# Vivado block design design_2, xc7z020clg400-1, Vivado 2024.2
# (continued, part 2 of 3)
current_bd_instance /zlcfq_sixteen/half_mul1/zlcfq/addcell13
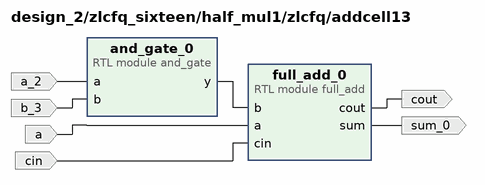
[diagram p24: block diagram inside /zlcfq_sixteen/half_mul1/zlcfq/addcell13]
create_bd_pin -dir I cin
create_bd_pin -dir O cout
create_bd_pin -dir I a
create_bd_pin -dir O sum_0
create_bd_pin -dir I a_2
create_bd_pin -dir I b_3

create_bd_cell -type module -reference full_add full_add_0
create_bd_cell -type module -reference and_gate and_gate_0

# ---- hierarchy /zlcfq_sixteen/half_mul1/zlcfq/addcell1 ----
current_bd_instance /zlcfq_sixteen/half_mul1/zlcfq/addcell1
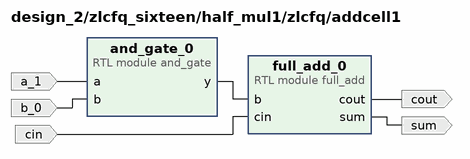
[diagram p25: block diagram inside /zlcfq_sixteen/half_mul1/zlcfq/addcell1]
create_bd_pin -dir I cin
create_bd_pin -dir O cout
create_bd_pin -dir O sum
create_bd_pin -dir I a_1
create_bd_pin -dir I b_0

create_bd_cell -type module -reference full_add full_add_0
create_bd_cell -type module -reference and_gate and_gate_0

# ---- hierarchy /zlcfq_sixteen/half_mul1/zlcfq/addcell2 ----
current_bd_instance /zlcfq_sixteen/half_mul1/zlcfq/addcell2
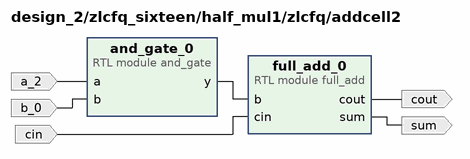
[diagram p26: block diagram inside /zlcfq_sixteen/half_mul1/zlcfq/addcell2]
create_bd_pin -dir I cin
create_bd_pin -dir O cout
create_bd_pin -dir O sum
create_bd_pin -dir I a_2
create_bd_pin -dir I b_0

create_bd_cell -type module -reference full_add full_add_0
create_bd_cell -type module -reference and_gate and_gate_0

# ---- hierarchy /zlcfq_sixteen/half_mul1/zlcfq/addcell14 ----
current_bd_instance /zlcfq_sixteen/half_mul1/zlcfq/addcell14
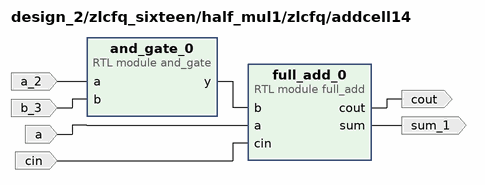
[diagram p27: block diagram inside /zlcfq_sixteen/half_mul1/zlcfq/addcell14]
create_bd_pin -dir I cin
create_bd_pin -dir O cout
create_bd_pin -dir I a
create_bd_pin -dir O sum_1
create_bd_pin -dir I a_2
create_bd_pin -dir I b_3

create_bd_cell -type module -reference full_add full_add_0
create_bd_cell -type module -reference and_gate and_gate_0

# ---- hierarchy /zlcfq_sixteen/half_mul1/zlcfq/addcell3 ----
current_bd_instance /zlcfq_sixteen/half_mul1/zlcfq/addcell3
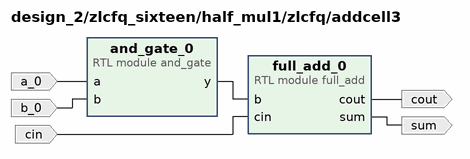
[diagram p28: block diagram inside /zlcfq_sixteen/half_mul1/zlcfq/addcell3]
create_bd_pin -dir I cin
create_bd_pin -dir O sum
create_bd_pin -dir O cout
create_bd_pin -dir I a_0
create_bd_pin -dir I b_0

create_bd_cell -type module -reference full_add full_add_0
create_bd_cell -type module -reference and_gate and_gate_0

# ---- hierarchy /zlcfq_sixteen/half_mul1/zlcfq/addcell4 ----
current_bd_instance /zlcfq_sixteen/half_mul1/zlcfq/addcell4
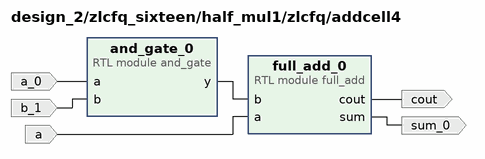
[diagram p29: block diagram inside /zlcfq_sixteen/half_mul1/zlcfq/addcell4]
create_bd_pin -dir I a
create_bd_pin -dir O cout
create_bd_pin -dir O sum_0
create_bd_pin -dir I a_0
create_bd_pin -dir I b_1

create_bd_cell -type module -reference full_add full_add_0
create_bd_cell -type module -reference and_gate and_gate_0

# ---- hierarchy /zlcfq_sixteen/half_mul1/zlcfq/addcell5 ----
current_bd_instance /zlcfq_sixteen/half_mul1/zlcfq/addcell5
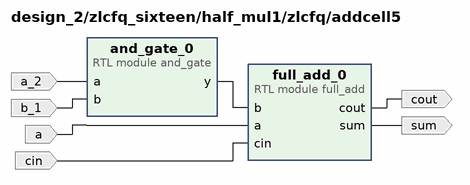
[diagram p30: block diagram inside /zlcfq_sixteen/half_mul1/zlcfq/addcell5]
create_bd_pin -dir I cin
create_bd_pin -dir O cout
create_bd_pin -dir I a
create_bd_pin -dir O sum
create_bd_pin -dir I a_2
create_bd_pin -dir I b_1

create_bd_cell -type module -reference full_add full_add_0
create_bd_cell -type module -reference and_gate and_gate_0

# ---- hierarchy /zlcfq_sixteen/half_mul1/zlcfq/addcell6 ----
current_bd_instance /zlcfq_sixteen/half_mul1/zlcfq/addcell6
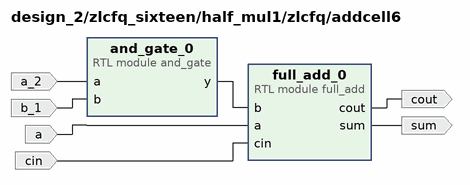
[diagram p31: block diagram inside /zlcfq_sixteen/half_mul1/zlcfq/addcell6]
create_bd_pin -dir I cin
create_bd_pin -dir O cout
create_bd_pin -dir I a
create_bd_pin -dir O sum
create_bd_pin -dir I a_2
create_bd_pin -dir I b_1

create_bd_cell -type module -reference full_add full_add_0
create_bd_cell -type module -reference and_gate and_gate_0

# ---- hierarchy /zlcfq_sixteen/half_mul1/zlcfq/addcell7 ----
current_bd_instance /zlcfq_sixteen/half_mul1/zlcfq/addcell7
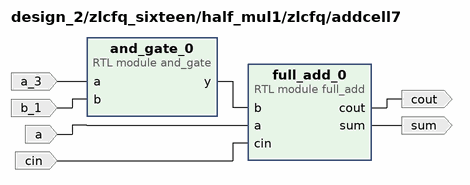
[diagram p32: block diagram inside /zlcfq_sixteen/half_mul1/zlcfq/addcell7]
create_bd_pin -dir I cin
create_bd_pin -dir O sum
create_bd_pin -dir I a
create_bd_pin -dir O cout
create_bd_pin -dir I a_3
create_bd_pin -dir I b_1

create_bd_cell -type module -reference full_add full_add_0
create_bd_cell -type module -reference and_gate and_gate_0

# ---- hierarchy /zlcfq_sixteen/half_mul1/zlcfq/addcell8 ----
current_bd_instance /zlcfq_sixteen/half_mul1/zlcfq/addcell8
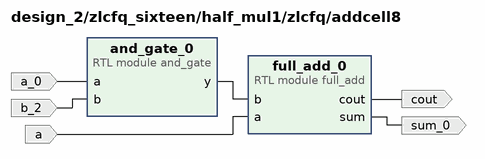
[diagram p33: block diagram inside /zlcfq_sixteen/half_mul1/zlcfq/addcell8]
create_bd_pin -dir O cout
create_bd_pin -dir I a
create_bd_pin -dir O sum_0
create_bd_pin -dir I a_0
create_bd_pin -dir I b_2

create_bd_cell -type module -reference full_add full_add_0
create_bd_cell -type module -reference and_gate and_gate_0

# ---- hierarchy /zlcfq_sixteen/half_mul1/zlcfq/addcell9 ----
current_bd_instance /zlcfq_sixteen/half_mul1/zlcfq/addcell9
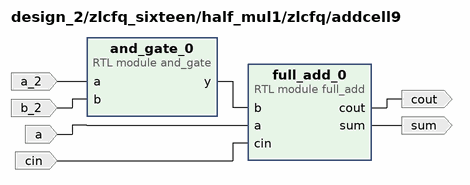
[diagram p34: block diagram inside /zlcfq_sixteen/half_mul1/zlcfq/addcell9]
create_bd_pin -dir O cout
create_bd_pin -dir I cin
create_bd_pin -dir I a
create_bd_pin -dir O sum
create_bd_pin -dir I a_2
create_bd_pin -dir I b_2

create_bd_cell -type module -reference full_add full_add_0
create_bd_cell -type module -reference and_gate and_gate_0

# ---- hierarchy /zlcfq_sixteen/half_mul1/zlcfq/addcell10 ----
current_bd_instance /zlcfq_sixteen/half_mul1/zlcfq/addcell10
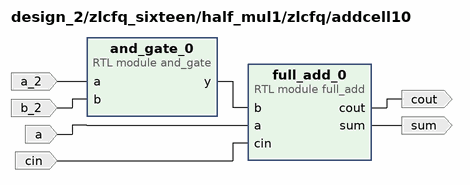
[diagram p35: block diagram inside /zlcfq_sixteen/half_mul1/zlcfq/addcell10]
create_bd_pin -dir O cout
create_bd_pin -dir I cin
create_bd_pin -dir I a
create_bd_pin -dir O sum
create_bd_pin -dir I a_2
create_bd_pin -dir I b_2

create_bd_cell -type module -reference full_add full_add_0
create_bd_cell -type module -reference and_gate and_gate_0

# ---- hierarchy /zlcfq_sixteen/half_mul1/zlcfq/addcell11 ----
current_bd_instance /zlcfq_sixteen/half_mul1/zlcfq/addcell11
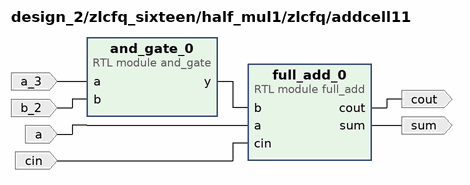
[diagram p36: block diagram inside /zlcfq_sixteen/half_mul1/zlcfq/addcell11]
create_bd_pin -dir I cin
create_bd_pin -dir I a
create_bd_pin -dir O sum
create_bd_pin -dir O cout
create_bd_pin -dir I a_3
create_bd_pin -dir I b_2

create_bd_cell -type module -reference full_add full_add_0
create_bd_cell -type module -reference and_gate and_gate_0

# ---- hierarchy /zlcfq_sixteen/half_mul1/zlcfq/addcell12 ----
current_bd_instance /zlcfq_sixteen/half_mul1/zlcfq/addcell12
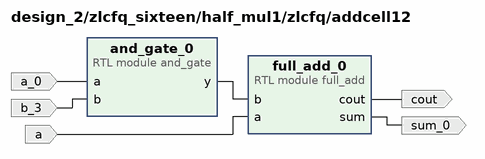
[diagram p37: block diagram inside /zlcfq_sixteen/half_mul1/zlcfq/addcell12]
create_bd_pin -dir I a
create_bd_pin -dir O cout
create_bd_pin -dir O sum_0
create_bd_pin -dir I a_0
create_bd_pin -dir I b_3

create_bd_cell -type module -reference full_add full_add_0
create_bd_cell -type module -reference and_gate and_gate_0

# ---- hierarchy /zlcfq_sixteen/half_mul1/zlcfq/addcell0 ----
current_bd_instance /zlcfq_sixteen/half_mul1/zlcfq/addcell0
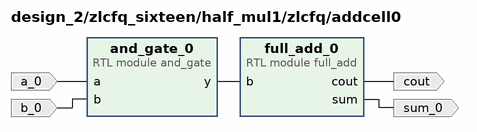
[diagram p38: block diagram inside /zlcfq_sixteen/half_mul1/zlcfq/addcell0]
create_bd_pin -dir O cout
create_bd_pin -dir O sum_0
create_bd_pin -dir I a_0
create_bd_pin -dir I b_0

create_bd_cell -type module -reference full_add full_add_0
create_bd_cell -type module -reference and_gate and_gate_0

# ---- hierarchy /zlcfq_sixteen/half_mul1/zlcfq/addcell15 ----
current_bd_instance /zlcfq_sixteen/half_mul1/zlcfq/addcell15
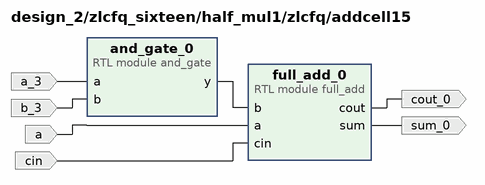
[diagram p39: block diagram inside /zlcfq_sixteen/half_mul1/zlcfq/addcell15]
create_bd_pin -dir I cin
create_bd_pin -dir I a
create_bd_pin -dir O sum_0
create_bd_pin -dir O cout_0
create_bd_pin -dir I a_3
create_bd_pin -dir I b_3

create_bd_cell -type module -reference full_add full_add_0
create_bd_cell -type module -reference and_gate and_gate_0

# ---- hierarchy /zlcfq_sixteen/half_mul1/ADD ----
current_bd_instance /zlcfq_sixteen/half_mul1/ADD
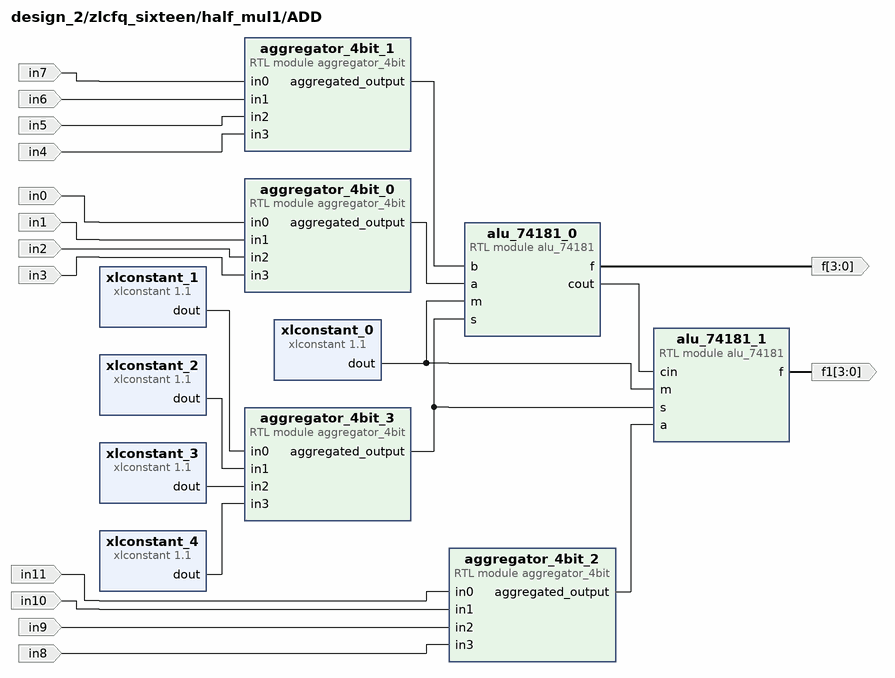
[diagram p40: block diagram inside /zlcfq_sixteen/half_mul1/ADD]
create_bd_pin -dir I in3
create_bd_pin -dir I in2
create_bd_pin -dir I in1
create_bd_pin -dir I in0
create_bd_pin -dir I in4
create_bd_pin -dir I in5
create_bd_pin -dir I in6
create_bd_pin -dir I in7
create_bd_pin -dir I in8
create_bd_pin -dir I in9
create_bd_pin -dir I in10
create_bd_pin -dir I in11
create_bd_pin -dir O -from 3 -to 0 f
create_bd_pin -dir O -from 3 -to 0 f1

create_bd_cell -type ip -vlnv xilinx.com:ip:xlconstant:1.1 xlconstant_0
set_property -dict {CONFIG.CONST_VAL 0 CONFIG.CONST_WIDTH 1} [get_bd_cells xlconstant_0]
create_bd_cell -type ip -vlnv xilinx.com:ip:xlconstant:1.1 xlconstant_1
set_property -dict {CONFIG.CONST_WIDTH 1} [get_bd_cells xlconstant_1]
create_bd_cell -type module -reference aggregator_4bit aggregator_4bit_0
create_bd_cell -type module -reference aggregator_4bit aggregator_4bit_1
create_bd_cell -type ip -vlnv xilinx.com:ip:xlconstant:1.1 xlconstant_2
set_property -dict {CONFIG.CONST_VAL 0 CONFIG.CONST_WIDTH 1} [get_bd_cells xlconstant_2]
create_bd_cell -type ip -vlnv xilinx.com:ip:xlconstant:1.1 xlconstant_3
set_property -dict {CONFIG.CONST_VAL 0 CONFIG.CONST_WIDTH 1} [get_bd_cells xlconstant_3]
create_bd_cell -type module -reference aggregator_4bit aggregator_4bit_2
create_bd_cell -type module -reference aggregator_4bit aggregator_4bit_3
create_bd_cell -type ip -vlnv xilinx.com:ip:xlconstant:1.1 xlconstant_4
set_property -dict {CONFIG.CONST_WIDTH 1} [get_bd_cells xlconstant_4]
create_bd_cell -type module -reference alu_74181 alu_74181_0
create_bd_cell -type module -reference alu_74181 alu_74181_1

# ---- hierarchy /SUM ----
current_bd_instance /SUM
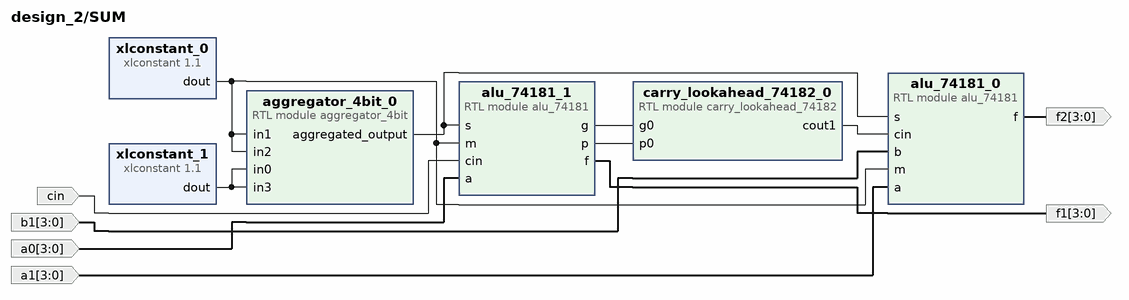
[diagram p41: block diagram inside /SUM]
create_bd_pin -dir I -from 3 -to 0 a1
create_bd_pin -dir I -from 3 -to 0 b1
create_bd_pin -dir O -from 3 -to 0 f2
create_bd_pin -dir I -from 3 -to 0 a0
create_bd_pin -dir O -from 3 -to 0 f1
create_bd_pin -dir I cin

create_bd_cell -type ip -vlnv xilinx.com:ip:xlconstant:1.1 xlconstant_0
set_property -dict {CONFIG.CONST_VAL 0} [get_bd_cells xlconstant_0]
create_bd_cell -type module -reference aggregator_4bit aggregator_4bit_0
create_bd_cell -type ip -vlnv xilinx.com:ip:xlconstant:1.1 xlconstant_1
set_property -dict {CONFIG.CONST_VAL 1} [get_bd_cells xlconstant_1]
create_bd_cell -type module -reference alu_74181 alu_74181_0
create_bd_cell -type module -reference alu_74181 alu_74181_1
create_bd_cell -type module -reference carry_lookahead_74182 carry_lookahead_74182_0

# ---- hierarchy /SUM1 ----
current_bd_instance /SUM1
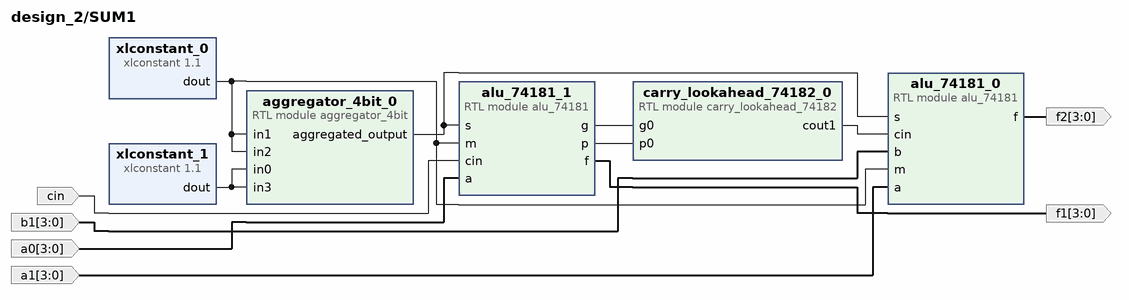
[diagram p42: block diagram inside /SUM1]
create_bd_pin -dir I -from 3 -to 0 a1
create_bd_pin -dir I -from 3 -to 0 b1
create_bd_pin -dir O -from 3 -to 0 f2
create_bd_pin -dir I -from 3 -to 0 a0
create_bd_pin -dir O -from 3 -to 0 f1
create_bd_pin -dir I cin

create_bd_cell -type ip -vlnv xilinx.com:ip:xlconstant:1.1 xlconstant_0
set_property -dict {CONFIG.CONST_VAL 0} [get_bd_cells xlconstant_0]
create_bd_cell -type module -reference aggregator_4bit aggregator_4bit_0
create_bd_cell -type ip -vlnv xilinx.com:ip:xlconstant:1.1 xlconstant_1
set_property -dict {CONFIG.CONST_VAL 1} [get_bd_cells xlconstant_1]
create_bd_cell -type module -reference alu_74181 alu_74181_0
create_bd_cell -type module -reference alu_74181 alu_74181_1
create_bd_cell -type module -reference carry_lookahead_74182 carry_lookahead_74182_0

# ---- connections ----

current_bd_instance /zlcfq_sixteen
connect_bd_net -net adpt_in_0_a0 [get_bd_pins a_0] [get_bd_pins half_mul1/a_0] [get_bd_pins half_mul/a_0]
connect_bd_net -net adpt_in_0_a1 [get_bd_pins a_1] [get_bd_pins half_mul1/a_1] [get_bd_pins half_mul/a_1]
connect_bd_net -net adpt_in_0_a2 [get_bd_pins a_2] [get_bd_pins half_mul1/a_2] [get_bd_pins half_mul/a_2]
connect_bd_net -net adpt_in_0_a3 [get_bd_pins a_3] [get_bd_pins half_mul1/a_3] [get_bd_pins half_mul/a_3]
connect_bd_net -net adpt_in_0_a4 [get_bd_pins a_4] [get_bd_pins half_mul1/a_4] [get_bd_pins half_mul/a_4]
connect_bd_net -net adpt_in_0_a5 [get_bd_pins a_5] [get_bd_pins half_mul1/a_5] [get_bd_pins half_mul/a_5]
connect_bd_net -net adpt_in_0_a6 [get_bd_pins a_6] [get_bd_pins half_mul1/a_6] [get_bd_pins half_mul/a_6]
connect_bd_net -net adpt_in_0_a7 [get_bd_pins a_7] [get_bd_pins half_mul1/a_7] [get_bd_pins half_mul/a_7]
connect_bd_net -net adpt_in_1_a0 [get_bd_pins b_0] [get_bd_pins half_mul/b_0]
connect_bd_net -net adpt_in_1_a1 [get_bd_pins b_1] [get_bd_pins half_mul/b_1]
connect_bd_net -net adpt_in_1_a2 [get_bd_pins b_2] [get_bd_pins half_mul/b_2]
connect_bd_net -net adpt_in_1_a3 [get_bd_pins b_3] [get_bd_pins half_mul/b_3]
connect_bd_net -net adpt_in_1_a4 [get_bd_pins b_4] [get_bd_pins half_mul1/b_0]
connect_bd_net -net adpt_in_1_a5 [get_bd_pins b_5] [get_bd_pins half_mul1/b_1]
connect_bd_net -net adpt_in_1_a6 [get_bd_pins b_6] [get_bd_pins half_mul1/b_2]
connect_bd_net -net adpt_in_1_a7 [get_bd_pins b_7] [get_bd_pins half_mul1/b_3]
connect_bd_net -net alu_74181_0_f [get_bd_pins SUM/f] [get_bd_pins f2]
connect_bd_net -net alu_74181_1_f [get_bd_pins SUM/f1] [get_bd_pins f1]
connect_bd_net -net alu_74181_2_f [get_bd_pins SUM/f2] [get_bd_pins f3]
connect_bd_net [get_bd_pins half_mul1/f0] [get_bd_pins SUM/b1]
connect_bd_net [get_bd_pins half_mul1/f1] [get_bd_pins SUM/b]
connect_bd_net [get_bd_pins half_mul1/f2] [get_bd_pins SUM/a2]
connect_bd_net [get_bd_pins half_mul/f0] [get_bd_pins f0]
connect_bd_net [get_bd_pins half_mul/f1] [get_bd_pins SUM/a1]
connect_bd_net [get_bd_pins half_mul/f2] [get_bd_pins SUM/a]

current_bd_instance /zlcfq_sixteen/SUM
connect_bd_net [get_bd_pins aggregator_4bit_0/aggregated_output] [get_bd_pins alu_74181_0/s] [get_bd_pins alu_74181_1/s] [get_bd_pins alu_74181_2/s]
connect_bd_net [get_bd_pins alu_74181_0/cout] [get_bd_pins alu_74181_2/cin]
connect_bd_net [get_bd_pins alu_74181_0/f] [get_bd_pins f]
connect_bd_net [get_bd_pins alu_74181_1/f] [get_bd_pins f1]
connect_bd_net [get_bd_pins alu_74181_1/g] [get_bd_pins carry_lookahead_74182_0/g0]
connect_bd_net [get_bd_pins alu_74181_1/p] [get_bd_pins carry_lookahead_74182_0/p0]
connect_bd_net [get_bd_pins alu_74181_2/f] [get_bd_pins f2]
connect_bd_net [get_bd_pins carry_lookahead_74182_0/cout1] [get_bd_pins alu_74181_0/cin]
connect_bd_net -net half_mul1_f0 [get_bd_pins b1] [get_bd_pins alu_74181_1/b]
connect_bd_net -net half_mul1_f1 [get_bd_pins b] [get_bd_pins alu_74181_0/b]
connect_bd_net -net half_mul1_f2 [get_bd_pins a2] [get_bd_pins alu_74181_2/a]
connect_bd_net -net half_mul_f1 [get_bd_pins a1] [get_bd_pins alu_74181_1/a]
connect_bd_net -net half_mul_f2 [get_bd_pins a] [get_bd_pins alu_74181_0/a]
connect_bd_net [get_bd_pins xlconstant_0/dout] \
  [get_bd_pins alu_74181_0/m] [get_bd_pins alu_74181_1/m] [get_bd_pins aggregator_4bit_0/in1] \
  [get_bd_pins aggregator_4bit_0/in2] [get_bd_pins alu_74181_2/m]
connect_bd_net [get_bd_pins xlconstant_1/dout] [get_bd_pins aggregator_4bit_0/in3] [get_bd_pins aggregator_4bit_0/in0]

current_bd_instance /zlcfq_sixteen/half_mul
connect_bd_net -net adpt_in_0_a0 [get_bd_pins a_0] [get_bd_pins zlcfq/a_0]
connect_bd_net -net adpt_in_0_a1 [get_bd_pins a_1] [get_bd_pins zlcfq/a_1]
connect_bd_net -net adpt_in_0_a2 [get_bd_pins a_2] [get_bd_pins zlcfq/a_2]
connect_bd_net -net adpt_in_0_a3 [get_bd_pins a_3] [get_bd_pins zlcfq/a_3]
connect_bd_net -net adpt_in_0_a4 [get_bd_pins a_4] [get_bd_pins zlcfq1/a_0]
connect_bd_net -net adpt_in_0_a5 [get_bd_pins a_5] [get_bd_pins zlcfq1/a_1]
connect_bd_net -net adpt_in_0_a6 [get_bd_pins a_6] [get_bd_pins zlcfq1/a_2]
connect_bd_net -net adpt_in_0_a7 [get_bd_pins a_7] [get_bd_pins zlcfq1/a_3]
connect_bd_net -net adpt_in_1_a0 [get_bd_pins b_0] [get_bd_pins zlcfq/b_0] [get_bd_pins zlcfq1/b_0]
connect_bd_net -net adpt_in_1_a1 [get_bd_pins b_1] [get_bd_pins zlcfq/b_1] [get_bd_pins zlcfq1/b_1]
connect_bd_net -net adpt_in_1_a2 [get_bd_pins b_2] [get_bd_pins zlcfq/b_2] [get_bd_pins zlcfq1/b_2]
connect_bd_net -net adpt_in_1_a3 [get_bd_pins b_3] [get_bd_pins zlcfq/b_3] [get_bd_pins zlcfq1/b_3]
connect_bd_net [get_bd_pins aggregator_4bit_0/aggregated_output] [get_bd_pins f0]
connect_bd_net -net alu_74181_0_f [get_bd_pins ADD/f] [get_bd_pins f1]
connect_bd_net -net alu_74181_1_f [get_bd_pins ADD/f1] [get_bd_pins f2]
connect_bd_net [get_bd_pins zlcfq1/out_0] [get_bd_pins ADD/in7]
connect_bd_net [get_bd_pins zlcfq1/out_1] [get_bd_pins ADD/in6]
connect_bd_net [get_bd_pins zlcfq1/out_2] [get_bd_pins ADD/in5]
connect_bd_net [get_bd_pins zlcfq1/out_3] [get_bd_pins ADD/in4]
connect_bd_net [get_bd_pins zlcfq1/out_4] [get_bd_pins ADD/in11]
connect_bd_net [get_bd_pins zlcfq1/out_5] [get_bd_pins ADD/in10]
connect_bd_net [get_bd_pins zlcfq1/out_6] [get_bd_pins ADD/in9]
connect_bd_net [get_bd_pins zlcfq1/out_7] [get_bd_pins ADD/in8]
connect_bd_net [get_bd_pins zlcfq/out_0] [get_bd_pins aggregator_4bit_0/in0]
connect_bd_net [get_bd_pins zlcfq/out_1] [get_bd_pins aggregator_4bit_0/in1]
connect_bd_net [get_bd_pins zlcfq/out_2] [get_bd_pins aggregator_4bit_0/in2]
connect_bd_net [get_bd_pins zlcfq/out_3] [get_bd_pins aggregator_4bit_0/in3]
connect_bd_net [get_bd_pins zlcfq/out_4] [get_bd_pins ADD/in0]
connect_bd_net [get_bd_pins zlcfq/out_5] [get_bd_pins ADD/in1]
connect_bd_net [get_bd_pins zlcfq/out_6] [get_bd_pins ADD/in2]
connect_bd_net [get_bd_pins zlcfq/out_7] [get_bd_pins ADD/in3]

current_bd_instance /zlcfq_sixteen/half_mul/zlcfq
connect_bd_net -net a_0_0_1 [get_bd_pins a_0] \
  [get_bd_pins addcell0/a_0] [get_bd_pins addcell8/a_0] [get_bd_pins addcell12/a_0] [get_bd_pins addcell4/a_0]
connect_bd_net -net a_0_1_1 [get_bd_pins a_3] \
  [get_bd_pins addcell7/a_3] [get_bd_pins addcell11/a_3] [get_bd_pins addcell15/a_3] [get_bd_pins addcell3/a_0]
connect_bd_net -net a_1_0_1 [get_bd_pins a_1] \
  [get_bd_pins addcell1/a_1] [get_bd_pins addcell5/a_2] [get_bd_pins addcell9/a_2] [get_bd_pins addcell13/a_2]
connect_bd_net -net a_2_0_1 [get_bd_pins a_2] \
  [get_bd_pins addcell6/a_2] [get_bd_pins addcell10/a_2] [get_bd_pins addcell14/a_2] [get_bd_pins addcell2/a_2]
connect_bd_net [get_bd_pins addcell0/cout] [get_bd_pins addcell1/cin]
connect_bd_net [get_bd_pins addcell0/sum_0] [get_bd_pins out_0]
connect_bd_net [get_bd_pins addcell10/sum] [get_bd_pins addcell13/a]
connect_bd_net [get_bd_pins addcell11/cout] [get_bd_pins addcell15/a]
connect_bd_net [get_bd_pins addcell11/sum] [get_bd_pins addcell14/a]
connect_bd_net [get_bd_pins addcell12/cout] [get_bd_pins addcell13/cin]
connect_bd_net [get_bd_pins addcell12/sum_0] [get_bd_pins out_3]
connect_bd_net [get_bd_pins addcell13/cout] [get_bd_pins addcell14/cin]
connect_bd_net [get_bd_pins addcell13/sum_0] [get_bd_pins out_4]
connect_bd_net [get_bd_pins addcell14/cout] [get_bd_pins addcell15/cin]
connect_bd_net [get_bd_pins addcell14/sum_1] [get_bd_pins out_5]
connect_bd_net [get_bd_pins addcell15/cout_0] [get_bd_pins out_7]
connect_bd_net [get_bd_pins addcell15/sum_0] [get_bd_pins out_6]
connect_bd_net [get_bd_pins addcell1/cout] [get_bd_pins addcell2/cin]
connect_bd_net [get_bd_pins addcell1/sum] [get_bd_pins addcell4/a]
connect_bd_net [get_bd_pins addcell2/cout] [get_bd_pins addcell3/cin]
connect_bd_net [get_bd_pins addcell2/sum] [get_bd_pins addcell5/a]
connect_bd_net [get_bd_pins addcell3/cout] [get_bd_pins addcell7/a]
connect_bd_net [get_bd_pins addcell3/sum] [get_bd_pins addcell6/a]
connect_bd_net [get_bd_pins addcell4/cout] [get_bd_pins addcell5/cin]
connect_bd_net [get_bd_pins addcell4/sum_0] [get_bd_pins out_1]
connect_bd_net [get_bd_pins addcell5/cout] [get_bd_pins addcell6/cin]
connect_bd_net [get_bd_pins addcell5/sum] [get_bd_pins addcell8/a]
connect_bd_net [get_bd_pins addcell6/cout] [get_bd_pins addcell7/cin]
connect_bd_net [get_bd_pins addcell6/sum] [get_bd_pins addcell9/a]
connect_bd_net [get_bd_pins addcell7/cout] [get_bd_pins addcell11/a]
connect_bd_net [get_bd_pins addcell7/sum] [get_bd_pins addcell10/a]
connect_bd_net [get_bd_pins addcell8/cout] [get_bd_pins addcell9/cin]
connect_bd_net [get_bd_pins addcell8/sum_0] [get_bd_pins out_2]
connect_bd_net [get_bd_pins addcell9/cout] [get_bd_pins addcell10/cin]
connect_bd_net [get_bd_pins addcell9/sum] [get_bd_pins addcell12/a]
connect_bd_net -net b_0_1 [get_bd_pins b_0] \
  [get_bd_pins addcell2/b_0] [get_bd_pins addcell3/b_0] [get_bd_pins addcell0/b_0] [get_bd_pins addcell1/b_0]
connect_bd_net -net b_1_1 [get_bd_pins b_1] \
  [get_bd_pins addcell5/b_1] [get_bd_pins addcell6/b_1] [get_bd_pins addcell7/b_1] [get_bd_pins addcell4/b_1]
connect_bd_net -net b_2_1 [get_bd_pins b_2] \
  [get_bd_pins addcell9/b_2] [get_bd_pins addcell10/b_2] [get_bd_pins addcell11/b_2] [get_bd_pins addcell8/b_2]
connect_bd_net -net b_3_1 [get_bd_pins b_3] \
  [get_bd_pins addcell12/b_3] [get_bd_pins addcell14/b_3] [get_bd_pins addcell15/b_3] [get_bd_pins addcell13/b_3]
connect_bd_net -net cin_1 [get_bd_pins addcell10/cout] [get_bd_pins addcell11/cin]

current_bd_instance /zlcfq_sixteen/half_mul/zlcfq/addcell13
connect_bd_net [get_bd_pins a] [get_bd_pins full_add_0/a]
connect_bd_net -net a_2_1 [get_bd_pins a_2] [get_bd_pins and_gate_0/a]
connect_bd_net [get_bd_pins and_gate_0/y] [get_bd_pins full_add_0/b]
connect_bd_net -net b_3_1 [get_bd_pins b_3] [get_bd_pins and_gate_0/b]
connect_bd_net [get_bd_pins cin] [get_bd_pins full_add_0/cin]
connect_bd_net [get_bd_pins full_add_0/cout] [get_bd_pins cout]
connect_bd_net [get_bd_pins full_add_0/sum] [get_bd_pins sum_0]

current_bd_instance /zlcfq_sixteen/half_mul/zlcfq/addcell1
connect_bd_net -net a_0_1 [get_bd_pins a_1] [get_bd_pins and_gate_0/a]
connect_bd_net [get_bd_pins and_gate_0/y] [get_bd_pins full_add_0/b]
connect_bd_net -net b_0_1 [get_bd_pins b_0] [get_bd_pins and_gate_0/b]
connect_bd_net [get_bd_pins cin] [get_bd_pins full_add_0/cin]
connect_bd_net [get_bd_pins full_add_0/cout] [get_bd_pins cout]
connect_bd_net [get_bd_pins full_add_0/sum] [get_bd_pins sum]

current_bd_instance /zlcfq_sixteen/half_mul/zlcfq/addcell2
connect_bd_net -net a_0_1 [get_bd_pins a_2] [get_bd_pins and_gate_0/a]
connect_bd_net [get_bd_pins and_gate_0/y] [get_bd_pins full_add_0/b]
connect_bd_net -net b_0_1 [get_bd_pins b_0] [get_bd_pins and_gate_0/b]
connect_bd_net [get_bd_pins cin] [get_bd_pins full_add_0/cin]
connect_bd_net [get_bd_pins full_add_0/cout] [get_bd_pins cout]
connect_bd_net [get_bd_pins full_add_0/sum] [get_bd_pins sum]

current_bd_instance /zlcfq_sixteen/half_mul/zlcfq/addcell14
connect_bd_net [get_bd_pins a] [get_bd_pins full_add_0/a]
connect_bd_net -net a_2_1 [get_bd_pins a_2] [get_bd_pins and_gate_0/a]
connect_bd_net [get_bd_pins and_gate_0/y] [get_bd_pins full_add_0/b]
connect_bd_net -net b_3_1 [get_bd_pins b_3] [get_bd_pins and_gate_0/b]
connect_bd_net [get_bd_pins cin] [get_bd_pins full_add_0/cin]
connect_bd_net [get_bd_pins full_add_0/cout] [get_bd_pins cout]
connect_bd_net [get_bd_pins full_add_0/sum] [get_bd_pins sum_1]

current_bd_instance /zlcfq_sixteen/half_mul/zlcfq/addcell3
connect_bd_net -net a_0_1 [get_bd_pins a_0] [get_bd_pins and_gate_0/a]
connect_bd_net [get_bd_pins and_gate_0/y] [get_bd_pins full_add_0/b]
connect_bd_net -net b_0_1 [get_bd_pins b_0] [get_bd_pins and_gate_0/b]
connect_bd_net [get_bd_pins cin] [get_bd_pins full_add_0/cin]
connect_bd_net [get_bd_pins full_add_0/cout] [get_bd_pins cout]
connect_bd_net [get_bd_pins full_add_0/sum] [get_bd_pins sum]

current_bd_instance /zlcfq_sixteen/half_mul/zlcfq/addcell4
connect_bd_net -net a_0_1 [get_bd_pins a_0] [get_bd_pins and_gate_0/a]
connect_bd_net [get_bd_pins a] [get_bd_pins full_add_0/a]
connect_bd_net [get_bd_pins and_gate_0/y] [get_bd_pins full_add_0/b]
connect_bd_net -net b_1_1 [get_bd_pins b_1] [get_bd_pins and_gate_0/b]
connect_bd_net [get_bd_pins full_add_0/cout] [get_bd_pins cout]
connect_bd_net [get_bd_pins full_add_0/sum] [get_bd_pins sum_0]

current_bd_instance /zlcfq_sixteen/half_mul/zlcfq/addcell5
connect_bd_net [get_bd_pins a] [get_bd_pins full_add_0/a]
connect_bd_net -net a_2_1 [get_bd_pins a_2] [get_bd_pins and_gate_0/a]
connect_bd_net [get_bd_pins and_gate_0/y] [get_bd_pins full_add_0/b]
connect_bd_net -net b_1_1 [get_bd_pins b_1] [get_bd_pins and_gate_0/b]
connect_bd_net [get_bd_pins cin] [get_bd_pins full_add_0/cin]
connect_bd_net [get_bd_pins full_add_0/cout] [get_bd_pins cout]
connect_bd_net [get_bd_pins full_add_0/sum] [get_bd_pins sum]

current_bd_instance /zlcfq_sixteen/half_mul/zlcfq/addcell6
connect_bd_net [get_bd_pins a] [get_bd_pins full_add_0/a]
connect_bd_net -net a_2_1 [get_bd_pins a_2] [get_bd_pins and_gate_0/a]
connect_bd_net [get_bd_pins and_gate_0/y] [get_bd_pins full_add_0/b]
connect_bd_net -net b_1_1 [get_bd_pins b_1] [get_bd_pins and_gate_0/b]
connect_bd_net [get_bd_pins cin] [get_bd_pins full_add_0/cin]
connect_bd_net [get_bd_pins full_add_0/cout] [get_bd_pins cout]
connect_bd_net [get_bd_pins full_add_0/sum] [get_bd_pins sum]

current_bd_instance /zlcfq_sixteen/half_mul/zlcfq/addcell7
connect_bd_net [get_bd_pins a] [get_bd_pins full_add_0/a]
connect_bd_net -net a_3_1 [get_bd_pins a_3] [get_bd_pins and_gate_0/a]
connect_bd_net [get_bd_pins and_gate_0/y] [get_bd_pins full_add_0/b]
connect_bd_net -net b_1_1 [get_bd_pins b_1] [get_bd_pins and_gate_0/b]
connect_bd_net [get_bd_pins cin] [get_bd_pins full_add_0/cin]
connect_bd_net [get_bd_pins full_add_0/cout] [get_bd_pins cout]
connect_bd_net [get_bd_pins full_add_0/sum] [get_bd_pins sum]

current_bd_instance /zlcfq_sixteen/half_mul/zlcfq/addcell8
connect_bd_net -net a_0_1 [get_bd_pins a_0] [get_bd_pins and_gate_0/a]
connect_bd_net [get_bd_pins a] [get_bd_pins full_add_0/a]
connect_bd_net [get_bd_pins and_gate_0/y] [get_bd_pins full_add_0/b]
connect_bd_net -net b_2_1 [get_bd_pins b_2] [get_bd_pins and_gate_0/b]
connect_bd_net [get_bd_pins full_add_0/cout] [get_bd_pins cout]
connect_bd_net [get_bd_pins full_add_0/sum] [get_bd_pins sum_0]

current_bd_instance /zlcfq_sixteen/half_mul/zlcfq/addcell9
connect_bd_net [get_bd_pins a] [get_bd_pins full_add_0/a]
connect_bd_net -net a_2_1 [get_bd_pins a_2] [get_bd_pins and_gate_0/a]
connect_bd_net [get_bd_pins and_gate_0/y] [get_bd_pins full_add_0/b]
connect_bd_net -net b_2_1 [get_bd_pins b_2] [get_bd_pins and_gate_0/b]
connect_bd_net [get_bd_pins cin] [get_bd_pins full_add_0/cin]
connect_bd_net [get_bd_pins full_add_0/cout] [get_bd_pins cout]
connect_bd_net [get_bd_pins full_add_0/sum] [get_bd_pins sum]

current_bd_instance /zlcfq_sixteen/half_mul/zlcfq/addcell10
connect_bd_net [get_bd_pins a] [get_bd_pins full_add_0/a]
connect_bd_net -net a_2_1 [get_bd_pins a_2] [get_bd_pins and_gate_0/a]
connect_bd_net [get_bd_pins and_gate_0/y] [get_bd_pins full_add_0/b]
connect_bd_net -net b_2_1 [get_bd_pins b_2] [get_bd_pins and_gate_0/b]
connect_bd_net [get_bd_pins cin] [get_bd_pins full_add_0/cin]
connect_bd_net [get_bd_pins full_add_0/cout] [get_bd_pins cout]
connect_bd_net [get_bd_pins full_add_0/sum] [get_bd_pins sum]

current_bd_instance /zlcfq_sixteen/half_mul/zlcfq/addcell11
connect_bd_net [get_bd_pins a] [get_bd_pins full_add_0/a]
connect_bd_net -net a_3_1 [get_bd_pins a_3] [get_bd_pins and_gate_0/a]
connect_bd_net [get_bd_pins and_gate_0/y] [get_bd_pins full_add_0/b]
connect_bd_net -net b_2_1 [get_bd_pins b_2] [get_bd_pins and_gate_0/b]
connect_bd_net [get_bd_pins cin] [get_bd_pins full_add_0/cin]
connect_bd_net [get_bd_pins full_add_0/cout] [get_bd_pins cout]
connect_bd_net [get_bd_pins full_add_0/sum] [get_bd_pins sum]

current_bd_instance /zlcfq_sixteen/half_mul/zlcfq/addcell12
connect_bd_net -net a_0_1 [get_bd_pins a_0] [get_bd_pins and_gate_0/a]
connect_bd_net [get_bd_pins a] [get_bd_pins full_add_0/a]
connect_bd_net [get_bd_pins and_gate_0/y] [get_bd_pins full_add_0/b]
connect_bd_net -net b_3_1 [get_bd_pins b_3] [get_bd_pins and_gate_0/b]
connect_bd_net [get_bd_pins full_add_0/cout] [get_bd_pins cout]
connect_bd_net [get_bd_pins full_add_0/sum] [get_bd_pins sum_0]

current_bd_instance /zlcfq_sixteen/half_mul/zlcfq/addcell0
connect_bd_net -net a_0_1 [get_bd_pins a_0] [get_bd_pins and_gate_0/a]
connect_bd_net [get_bd_pins and_gate_0/y] [get_bd_pins full_add_0/b]
connect_bd_net -net b_0_1 [get_bd_pins b_0] [get_bd_pins and_gate_0/b]
connect_bd_net [get_bd_pins full_add_0/cout] [get_bd_pins cout]
connect_bd_net [get_bd_pins full_add_0/sum] [get_bd_pins sum_0]

current_bd_instance /zlcfq_sixteen/half_mul/zlcfq/addcell15
connect_bd_net [get_bd_pins a] [get_bd_pins full_add_0/a]
connect_bd_net -net a_3_1 [get_bd_pins a_3] [get_bd_pins and_gate_0/a]
connect_bd_net [get_bd_pins and_gate_0/y] [get_bd_pins full_add_0/b]
connect_bd_net -net b_3_1 [get_bd_pins b_3] [get_bd_pins and_gate_0/b]
connect_bd_net [get_bd_pins cin] [get_bd_pins full_add_0/cin]
connect_bd_net [get_bd_pins full_add_0/cout] [get_bd_pins cout_0]
connect_bd_net [get_bd_pins full_add_0/sum] [get_bd_pins sum_0]

current_bd_instance /zlcfq_sixteen/half_mul/ADD
connect_bd_net [get_bd_pins aggregator_4bit_0/aggregated_output] [get_bd_pins alu_74181_0/a]
connect_bd_net [get_bd_pins aggregator_4bit_1/aggregated_output] [get_bd_pins alu_74181_0/b]
connect_bd_net [get_bd_pins aggregator_4bit_2/aggregated_output] [get_bd_pins alu_74181_1/a]
connect_bd_net [get_bd_pins aggregator_4bit_3/aggregated_output] [get_bd_pins alu_74181_1/s] [get_bd_pins alu_74181_0/s]
connect_bd_net [get_bd_pins alu_74181_0/cout] [get_bd_pins alu_74181_1/cin]
connect_bd_net [get_bd_pins alu_74181_0/f] [get_bd_pins f]
connect_bd_net [get_bd_pins alu_74181_1/f] [get_bd_pins f1]
connect_bd_net [get_bd_pins xlconstant_0/dout] [get_bd_pins alu_74181_1/m] [get_bd_pins alu_74181_0/m]
connect_bd_net [get_bd_pins xlconstant_1/dout] [get_bd_pins aggregator_4bit_3/in0]
connect_bd_net [get_bd_pins xlconstant_2/dout] [get_bd_pins aggregator_4bit_3/in1]
connect_bd_net [get_bd_pins xlconstant_3/dout] [get_bd_pins aggregator_4bit_3/in2]
connect_bd_net [get_bd_pins xlconstant_4/dout] [get_bd_pins aggregator_4bit_3/in3]
connect_bd_net -net zlcfq1_out_0 [get_bd_pins in7] [get_bd_pins aggregator_4bit_1/in0]
connect_bd_net -net zlcfq1_out_1 [get_bd_pins in6] [get_bd_pins aggregator_4bit_1/in1]
connect_bd_net -net zlcfq1_out_2 [get_bd_pins in5] [get_bd_pins aggregator_4bit_1/in2]
connect_bd_net -net zlcfq1_out_3 [get_bd_pins in4] [get_bd_pins aggregator_4bit_1/in3]
connect_bd_net -net zlcfq1_out_4 [get_bd_pins in11] [get_bd_pins aggregator_4bit_2/in0]
connect_bd_net -net zlcfq1_out_5 [get_bd_pins in10] [get_bd_pins aggregator_4bit_2/in1]
connect_bd_net -net zlcfq1_out_6 [get_bd_pins in9] [get_bd_pins aggregator_4bit_2/in2]
connect_bd_net -net zlcfq1_out_7 [get_bd_pins in8] [get_bd_pins aggregator_4bit_2/in3]
connect_bd_net -net zlcfq_out_4 [get_bd_pins in0] [get_bd_pins aggregator_4bit_0/in0]
connect_bd_net -net zlcfq_out_5 [get_bd_pins in1] [get_bd_pins aggregator_4bit_0/in1]
connect_bd_net -net zlcfq_out_6 [get_bd_pins in2] [get_bd_pins aggregator_4bit_0/in2]
connect_bd_net -net zlcfq_out_7 [get_bd_pins in3] [get_bd_pins aggregator_4bit_0/in3]

current_bd_instance /zlcfq_sixteen/half_mul1
connect_bd_net -net adpt_in_0_a0 [get_bd_pins a_0] [get_bd_pins zlcfq/a_0]
connect_bd_net -net adpt_in_0_a1 [get_bd_pins a_1] [get_bd_pins zlcfq/a_1]
connect_bd_net -net adpt_in_0_a2 [get_bd_pins a_2] [get_bd_pins zlcfq/a_2]
connect_bd_net -net adpt_in_0_a3 [get_bd_pins a_3] [get_bd_pins zlcfq/a_3]
connect_bd_net -net adpt_in_0_a4 [get_bd_pins a_4] [get_bd_pins zlcfq1/a_0]
connect_bd_net -net adpt_in_0_a5 [get_bd_pins a_5] [get_bd_pins zlcfq1/a_1]
connect_bd_net -net adpt_in_0_a6 [get_bd_pins a_6] [get_bd_pins zlcfq1/a_2]
connect_bd_net -net adpt_in_0_a7 [get_bd_pins a_7] [get_bd_pins zlcfq1/a_3]
connect_bd_net -net adpt_in_1_a0 [get_bd_pins b_0] [get_bd_pins zlcfq/b_0] [get_bd_pins zlcfq1/b_0]
connect_bd_net -net adpt_in_1_a1 [get_bd_pins b_1] [get_bd_pins zlcfq/b_1] [get_bd_pins zlcfq1/b_1]
connect_bd_net -net adpt_in_1_a2 [get_bd_pins b_2] [get_bd_pins zlcfq/b_2] [get_bd_pins zlcfq1/b_2]
connect_bd_net -net adpt_in_1_a3 [get_bd_pins b_3] [get_bd_pins zlcfq/b_3] [get_bd_pins zlcfq1/b_3]
connect_bd_net [get_bd_pins aggregator_4bit_0/aggregated_output] [get_bd_pins f0]
connect_bd_net -net alu_74181_0_f [get_bd_pins ADD/f] [get_bd_pins f1]
connect_bd_net -net alu_74181_1_f [get_bd_pins ADD/f1] [get_bd_pins f2]
connect_bd_net [get_bd_pins zlcfq1/out_0] [get_bd_pins ADD/in7]
connect_bd_net [get_bd_pins zlcfq1/out_1] [get_bd_pins ADD/in6]
connect_bd_net [get_bd_pins zlcfq1/out_2] [get_bd_pins ADD/in5]
connect_bd_net [get_bd_pins zlcfq1/out_3] [get_bd_pins ADD/in4]
connect_bd_net [get_bd_pins zlcfq1/out_4] [get_bd_pins ADD/in11]
connect_bd_net [get_bd_pins zlcfq1/out_5] [get_bd_pins ADD/in10]
connect_bd_net [get_bd_pins zlcfq1/out_6] [get_bd_pins ADD/in9]
connect_bd_net [get_bd_pins zlcfq1/out_7] [get_bd_pins ADD/in8]
connect_bd_net [get_bd_pins zlcfq/out_0] [get_bd_pins aggregator_4bit_0/in0]
connect_bd_net [get_bd_pins zlcfq/out_1] [get_bd_pins aggregator_4bit_0/in1]
connect_bd_net [get_bd_pins zlcfq/out_2] [get_bd_pins aggregator_4bit_0/in2]
connect_bd_net [get_bd_pins zlcfq/out_3] [get_bd_pins aggregator_4bit_0/in3]
connect_bd_net [get_bd_pins zlcfq/out_4] [get_bd_pins ADD/in0]
connect_bd_net [get_bd_pins zlcfq/out_5] [get_bd_pins ADD/in1]
connect_bd_net [get_bd_pins zlcfq/out_6] [get_bd_pins ADD/in2]
connect_bd_net [get_bd_pins zlcfq/out_7] [get_bd_pins ADD/in3]

current_bd_instance /zlcfq_sixteen/half_mul1/zlcfq
connect_bd_net -net a_0_0_1 [get_bd_pins a_0] \
  [get_bd_pins addcell0/a_0] [get_bd_pins addcell8/a_0] [get_bd_pins addcell12/a_0] [get_bd_pins addcell4/a_0]
connect_bd_net -net a_0_1_1 [get_bd_pins a_3] \
  [get_bd_pins addcell7/a_3] [get_bd_pins addcell11/a_3] [get_bd_pins addcell15/a_3] [get_bd_pins addcell3/a_0]
connect_bd_net -net a_1_0_1 [get_bd_pins a_1] \
  [get_bd_pins addcell1/a_1] [get_bd_pins addcell5/a_2] [get_bd_pins addcell9/a_2] [get_bd_pins addcell13/a_2]
connect_bd_net -net a_2_0_1 [get_bd_pins a_2] \
  [get_bd_pins addcell6/a_2] [get_bd_pins addcell10/a_2] [get_bd_pins addcell14/a_2] [get_bd_pins addcell2/a_2]
connect_bd_net [get_bd_pins addcell0/cout] [get_bd_pins addcell1/cin]
connect_bd_net [get_bd_pins addcell0/sum_0] [get_bd_pins out_0]
connect_bd_net [get_bd_pins addcell10/sum] [get_bd_pins addcell13/a]
connect_bd_net [get_bd_pins addcell11/cout] [get_bd_pins addcell15/a]
connect_bd_net [get_bd_pins addcell11/sum] [get_bd_pins addcell14/a]
connect_bd_net [get_bd_pins addcell12/cout] [get_bd_pins addcell13/cin]
connect_bd_net [get_bd_pins addcell12/sum_0] [get_bd_pins out_3]
connect_bd_net [get_bd_pins addcell13/cout] [get_bd_pins addcell14/cin]
connect_bd_net [get_bd_pins addcell13/sum_0] [get_bd_pins out_4]
connect_bd_net [get_bd_pins addcell14/cout] [get_bd_pins addcell15/cin]
connect_bd_net [get_bd_pins addcell14/sum_1] [get_bd_pins out_5]
connect_bd_net [get_bd_pins addcell15/cout_0] [get_bd_pins out_7]
connect_bd_net [get_bd_pins addcell15/sum_0] [get_bd_pins out_6]
connect_bd_net [get_bd_pins addcell1/cout] [get_bd_pins addcell2/cin]
connect_bd_net [get_bd_pins addcell1/sum] [get_bd_pins addcell4/a]
connect_bd_net [get_bd_pins addcell2/cout] [get_bd_pins addcell3/cin]
connect_bd_net [get_bd_pins addcell2/sum] [get_bd_pins addcell5/a]
connect_bd_net [get_bd_pins addcell3/cout] [get_bd_pins addcell7/a]
connect_bd_net [get_bd_pins addcell3/sum] [get_bd_pins addcell6/a]
connect_bd_net [get_bd_pins addcell4/cout] [get_bd_pins addcell5/cin]
connect_bd_net [get_bd_pins addcell4/sum_0] [get_bd_pins out_1]
connect_bd_net [get_bd_pins addcell5/cout] [get_bd_pins addcell6/cin]
connect_bd_net [get_bd_pins addcell5/sum] [get_bd_pins addcell8/a]
connect_bd_net [get_bd_pins addcell6/cout] [get_bd_pins addcell7/cin]
connect_bd_net [get_bd_pins addcell6/sum] [get_bd_pins addcell9/a]
connect_bd_net [get_bd_pins addcell7/cout] [get_bd_pins addcell11/a]
connect_bd_net [get_bd_pins addcell7/sum] [get_bd_pins addcell10/a]
connect_bd_net [get_bd_pins addcell8/cout] [get_bd_pins addcell9/cin]
connect_bd_net [get_bd_pins addcell8/sum_0] [get_bd_pins out_2]
connect_bd_net [get_bd_pins addcell9/cout] [get_bd_pins addcell10/cin]
connect_bd_net [get_bd_pins addcell9/sum] [get_bd_pins addcell12/a]
connect_bd_net -net b_0_1 [get_bd_pins b_0] \
  [get_bd_pins addcell2/b_0] [get_bd_pins addcell3/b_0] [get_bd_pins addcell0/b_0] [get_bd_pins addcell1/b_0]
connect_bd_net -net b_1_1 [get_bd_pins b_1] \
  [get_bd_pins addcell5/b_1] [get_bd_pins addcell6/b_1] [get_bd_pins addcell7/b_1] [get_bd_pins addcell4/b_1]
connect_bd_net -net b_2_1 [get_bd_pins b_2] \
  [get_bd_pins addcell9/b_2] [get_bd_pins addcell10/b_2] [get_bd_pins addcell11/b_2] [get_bd_pins addcell8/b_2]
connect_bd_net -net b_3_1 [get_bd_pins b_3] \
  [get_bd_pins addcell12/b_3] [get_bd_pins addcell14/b_3] [get_bd_pins addcell15/b_3] [get_bd_pins addcell13/b_3]
connect_bd_net -net cin_1 [get_bd_pins addcell10/cout] [get_bd_pins addcell11/cin]

current_bd_instance /zlcfq_sixteen/half_mul1/zlcfq/addcell13
connect_bd_net [get_bd_pins a] [get_bd_pins full_add_0/a]
connect_bd_net -net a_2_1 [get_bd_pins a_2] [get_bd_pins and_gate_0/a]
connect_bd_net [get_bd_pins and_gate_0/y] [get_bd_pins full_add_0/b]
connect_bd_net -net b_3_1 [get_bd_pins b_3] [get_bd_pins and_gate_0/b]
connect_bd_net [get_bd_pins cin] [get_bd_pins full_add_0/cin]
connect_bd_net [get_bd_pins full_add_0/cout] [get_bd_pins cout]
connect_bd_net [get_bd_pins full_add_0/sum] [get_bd_pins sum_0]

current_bd_instance /zlcfq_sixteen/half_mul1/zlcfq/addcell1
connect_bd_net -net a_0_1 [get_bd_pins a_1] [get_bd_pins and_gate_0/a]
connect_bd_net [get_bd_pins and_gate_0/y] [get_bd_pins full_add_0/b]
connect_bd_net -net b_0_1 [get_bd_pins b_0] [get_bd_pins and_gate_0/b]
connect_bd_net [get_bd_pins cin] [get_bd_pins full_add_0/cin]
connect_bd_net [get_bd_pins full_add_0/cout] [get_bd_pins cout]
connect_bd_net [get_bd_pins full_add_0/sum] [get_bd_pins sum]

current_bd_instance /zlcfq_sixteen/half_mul1/zlcfq/addcell2
connect_bd_net -net a_0_1 [get_bd_pins a_2] [get_bd_pins and_gate_0/a]
connect_bd_net [get_bd_pins and_gate_0/y] [get_bd_pins full_add_0/b]
connect_bd_net -net b_0_1 [get_bd_pins b_0] [get_bd_pins and_gate_0/b]
connect_bd_net [get_bd_pins cin] [get_bd_pins full_add_0/cin]
connect_bd_net [get_bd_pins full_add_0/cout] [get_bd_pins cout]
connect_bd_net [get_bd_pins full_add_0/sum] [get_bd_pins sum]

current_bd_instance /zlcfq_sixteen/half_mul1/zlcfq/addcell14
connect_bd_net [get_bd_pins a] [get_bd_pins full_add_0/a]
connect_bd_net -net a_2_1 [get_bd_pins a_2] [get_bd_pins and_gate_0/a]
connect_bd_net [get_bd_pins and_gate_0/y] [get_bd_pins full_add_0/b]
connect_bd_net -net b_3_1 [get_bd_pins b_3] [get_bd_pins and_gate_0/b]
connect_bd_net [get_bd_pins cin] [get_bd_pins full_add_0/cin]
connect_bd_net [get_bd_pins full_add_0/cout] [get_bd_pins cout]
connect_bd_net [get_bd_pins full_add_0/sum] [get_bd_pins sum_1]

current_bd_instance /zlcfq_sixteen/half_mul1/zlcfq/addcell3
connect_bd_net -net a_0_1 [get_bd_pins a_0] [get_bd_pins and_gate_0/a]
connect_bd_net [get_bd_pins and_gate_0/y] [get_bd_pins full_add_0/b]
connect_bd_net -net b_0_1 [get_bd_pins b_0] [get_bd_pins and_gate_0/b]
connect_bd_net [get_bd_pins cin] [get_bd_pins full_add_0/cin]
connect_bd_net [get_bd_pins full_add_0/cout] [get_bd_pins cout]
connect_bd_net [get_bd_pins full_add_0/sum] [get_bd_pins sum]

current_bd_instance /zlcfq_sixteen/half_mul1/zlcfq/addcell4
connect_bd_net -net a_0_1 [get_bd_pins a_0] [get_bd_pins and_gate_0/a]
connect_bd_net [get_bd_pins a] [get_bd_pins full_add_0/a]
connect_bd_net [get_bd_pins and_gate_0/y] [get_bd_pins full_add_0/b]
connect_bd_net -net b_1_1 [get_bd_pins b_1] [get_bd_pins and_gate_0/b]
connect_bd_net [get_bd_pins full_add_0/cout] [get_bd_pins cout]
connect_bd_net [get_bd_pins full_add_0/sum] [get_bd_pins sum_0]

current_bd_instance /zlcfq_sixteen/half_mul1/zlcfq/addcell5
connect_bd_net [get_bd_pins a] [get_bd_pins full_add_0/a]
connect_bd_net -net a_2_1 [get_bd_pins a_2] [get_bd_pins and_gate_0/a]
connect_bd_net [get_bd_pins and_gate_0/y] [get_bd_pins full_add_0/b]
connect_bd_net -net b_1_1 [get_bd_pins b_1] [get_bd_pins and_gate_0/b]
connect_bd_net [get_bd_pins cin] [get_bd_pins full_add_0/cin]
connect_bd_net [get_bd_pins full_add_0/cout] [get_bd_pins cout]
connect_bd_net [get_bd_pins full_add_0/sum] [get_bd_pins sum]

current_bd_instance /zlcfq_sixteen/half_mul1/zlcfq/addcell6
connect_bd_net [get_bd_pins a] [get_bd_pins full_add_0/a]
connect_bd_net -net a_2_1 [get_bd_pins a_2] [get_bd_pins and_gate_0/a]
connect_bd_net [get_bd_pins and_gate_0/y] [get_bd_pins full_add_0/b]
connect_bd_net -net b_1_1 [get_bd_pins b_1] [get_bd_pins and_gate_0/b]
connect_bd_net [get_bd_pins cin] [get_bd_pins full_add_0/cin]
connect_bd_net [get_bd_pins full_add_0/cout] [get_bd_pins cout]
connect_bd_net [get_bd_pins full_add_0/sum] [get_bd_pins sum]

current_bd_instance /zlcfq_sixteen/half_mul1/zlcfq/addcell7
connect_bd_net [get_bd_pins a] [get_bd_pins full_add_0/a]
connect_bd_net -net a_3_1 [get_bd_pins a_3] [get_bd_pins and_gate_0/a]
connect_bd_net [get_bd_pins and_gate_0/y] [get_bd_pins full_add_0/b]
connect_bd_net -net b_1_1 [get_bd_pins b_1] [get_bd_pins and_gate_0/b]
connect_bd_net [get_bd_pins cin] [get_bd_pins full_add_0/cin]
connect_bd_net [get_bd_pins full_add_0/cout] [get_bd_pins cout]
connect_bd_net [get_bd_pins full_add_0/sum] [get_bd_pins sum]

current_bd_instance /zlcfq_sixteen/half_mul1/zlcfq/addcell8
connect_bd_net -net a_0_1 [get_bd_pins a_0] [get_bd_pins and_gate_0/a]
connect_bd_net [get_bd_pins a] [get_bd_pins full_add_0/a]
connect_bd_net [get_bd_pins and_gate_0/y] [get_bd_pins full_add_0/b]
connect_bd_net -net b_2_1 [get_bd_pins b_2] [get_bd_pins and_gate_0/b]
connect_bd_net [get_bd_pins full_add_0/cout] [get_bd_pins cout]
connect_bd_net [get_bd_pins full_add_0/sum] [get_bd_pins sum_0]

current_bd_instance /zlcfq_sixteen/half_mul1/zlcfq/addcell9
connect_bd_net [get_bd_pins a] [get_bd_pins full_add_0/a]
connect_bd_net -net a_2_1 [get_bd_pins a_2] [get_bd_pins and_gate_0/a]
connect_bd_net [get_bd_pins and_gate_0/y] [get_bd_pins full_add_0/b]
connect_bd_net -net b_2_1 [get_bd_pins b_2] [get_bd_pins and_gate_0/b]
connect_bd_net [get_bd_pins cin] [get_bd_pins full_add_0/cin]
connect_bd_net [get_bd_pins full_add_0/cout] [get_bd_pins cout]
connect_bd_net [get_bd_pins full_add_0/sum] [get_bd_pins sum]

current_bd_instance /zlcfq_sixteen/half_mul1/zlcfq/addcell10
connect_bd_net [get_bd_pins a] [get_bd_pins full_add_0/a]
connect_bd_net -net a_2_1 [get_bd_pins a_2] [get_bd_pins and_gate_0/a]
connect_bd_net [get_bd_pins and_gate_0/y] [get_bd_pins full_add_0/b]
connect_bd_net -net b_2_1 [get_bd_pins b_2] [get_bd_pins and_gate_0/b]
connect_bd_net [get_bd_pins cin] [get_bd_pins full_add_0/cin]
connect_bd_net [get_bd_pins full_add_0/cout] [get_bd_pins cout]
connect_bd_net [get_bd_pins full_add_0/sum] [get_bd_pins sum]

current_bd_instance /zlcfq_sixteen/half_mul1/zlcfq/addcell11
connect_bd_net [get_bd_pins a] [get_bd_pins full_add_0/a]
connect_bd_net -net a_3_1 [get_bd_pins a_3] [get_bd_pins and_gate_0/a]
connect_bd_net [get_bd_pins and_gate_0/y] [get_bd_pins full_add_0/b]
connect_bd_net -net b_2_1 [get_bd_pins b_2] [get_bd_pins and_gate_0/b]
connect_bd_net [get_bd_pins cin] [get_bd_pins full_add_0/cin]
connect_bd_net [get_bd_pins full_add_0/cout] [get_bd_pins cout]
connect_bd_net [get_bd_pins full_add_0/sum] [get_bd_pins sum]

current_bd_instance /zlcfq_sixteen/half_mul1/zlcfq/addcell12
connect_bd_net -net a_0_1 [get_bd_pins a_0] [get_bd_pins and_gate_0/a]
connect_bd_net [get_bd_pins a] [get_bd_pins full_add_0/a]
connect_bd_net [get_bd_pins and_gate_0/y] [get_bd_pins full_add_0/b]
connect_bd_net -net b_3_1 [get_bd_pins b_3] [get_bd_pins and_gate_0/b]
connect_bd_net [get_bd_pins full_add_0/cout] [get_bd_pins cout]
connect_bd_net [get_bd_pins full_add_0/sum] [get_bd_pins sum_0]
